# Altium schematic sheet USB 2.0 CONTROLLER.SchDoc: USB 2.0 CONTROLLER
size A4; DrawnBy: ThanhQuoc; Revision: V01; SheetNumber: 15; SheetTotal: 21; Project: RV1126 CAMERA BOARD DESIGN
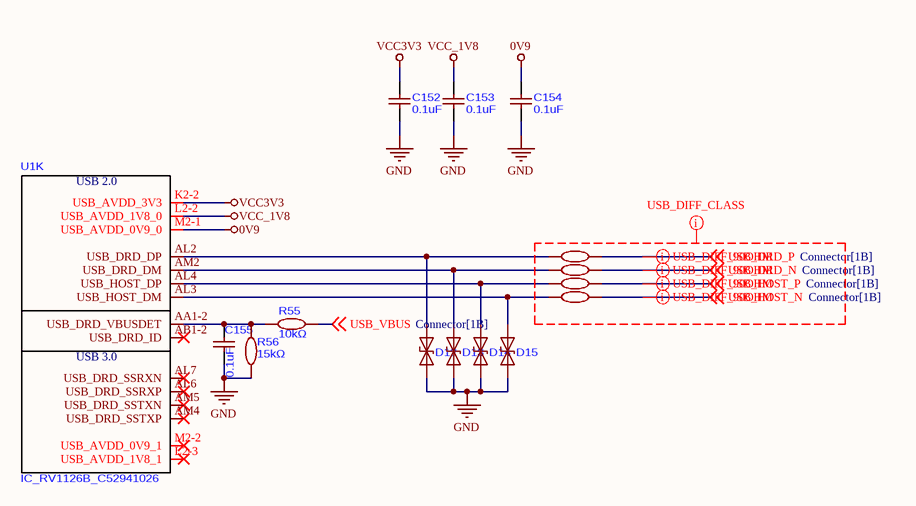
[diagram p0: USB 2.0 CONTROLLER.SchDoc]

## Parts
C152  0.1uF  [C0201]
C153  0.1uF  [C0201]
C154  0.1uF  [C0201]
C155  0.1uF  [C0201]
D12  ESD DIODE  [DSN0603-2_L0.7-W0.3-P0.40-BI]  (value not drawn)
D13  ESD DIODE  [DSN0603-2_L0.7-W0.3-P0.40-BI]  (value not drawn)
D14  ESD DIODE  [DSN0603-2_L0.7-W0.3-P0.40-BI]  (value not drawn)
D15  ESD DIODE  [DSN0603-2_L0.7-W0.3-P0.40-BI]  (value not drawn)
R51  2.2Ω  [R0201]  (value not drawn)
R52  2.2Ω  [R0201]  (value not drawn)
R53  2.2Ω  [R0201]  (value not drawn)
R54  2.2Ω  [R0201]  (value not drawn)
R55  10kΩ  [R0201]
R56  15kΩ  [R0201]
U1  IC_RV1126B_C52941026  [CCSP-491_L14.0-W14.0-TL_RV1126B]  (part K of 18)

## Nets
0V9: C154.2 U1.M2-1(USB_AVDD_0V9_0)
GND: C152.1 C153.1 C154.1 C155.1 D12.1(K) D13.1(K) D14.1(K) D15.1(K) R56.1
VCC3V3: C152.2 U1.K2-2(USB_AVDD_3V3)
VCC_1V8: C153.2 U1.L2-2(USB_AVDD_1V8_0)
USB_DRD_N: R52.2 ; off-sheet USB_DRD_N
USB_DRD_P: R51.2 ; off-sheet USB_DRD_P
USB_HOST_N: R54.2 ; off-sheet USB_HOST_N
USB_HOST_P: R53.2 ; off-sheet USB_HOST_P
USB_VBUS: R55.2 ; off-sheet USB_VBUS
NetC155_2: C155.2 R55.1 R56.2 U1.AA1-2(USB_DRD_VBUSDET)
NetD12_2: D12.2(A) R51.1 U1.AL2(USB_DRD_DP)
NetD13_2: D13.2(A) R52.1 U1.AM2(USB_DRD_DM)
NetD14_2: D14.2(A) R53.1 U1.AL4(USB_HOST_DP)
NetD15_2: D15.2(A) R54.1 U1.AL3(USB_HOST_DM)

Not connected (* = marked no-connect by the designer): U1 AB1-2(USB_DRD_ID)* AL6(USB_DRD_SSRXP)* AL7(USB_DRD_SSRXN)* AM4(USB_DRD_SSTXP)* AM5(USB_DRD_SSTXN)* L2-3(USB_AVDD_1V8_1)* M2-2(USB_AVDD_0V9_1)*

## Layout directives
net class USB_DIFF_CLASS: USB_DRD_N, USB_DRD_P, USB_HOST_N, USB_HOST_P
differential pair; differential pair class USB_DIFF_90OHM: USB_DRD_N, USB_DRD_P, USB_HOST_N, USB_HOST_P

## Notes on the sheet
- Title:
- Drawn By:
- Page Contents:
- Checked By:
- Size:
- Date:
- File:
- License:
- Email:
- A4
- nguyenthanhquoc0206@gmail.com
- Number:
- Time:
- Revision:
- Sheet
- Website:
- of
- https://www.facebook.com/ntq.687
- (in symbol IC_RV1126B_C52941026, part K) USB 2.0; USB 3.0

## Library data of the parts
C152-C155 = CAP_100nF-6.3V-10%-0201_1: 0.1uF ±10% 6.3V Ceramic Capacitor X5R 0201
D12-D15 = PESD5V0H1BSFYL: ESD DIODE 5VWM 5VC DSN0603-2 0.13PF
R51-R54 = RES_2.2-50mW-1%-0201: RES 2.2Ω ±1% 50mW 0201; ComponentLink1Description: LCSC; ComponentLink1URL: https://www.lcsc.com/product-detail/C295718.html?s_z=n_q_t_120%2520OHM&spm=wm.fly.bg.5.xh___wm.ssy.tc.1.tz&lcsc_vid=EwRWBFZSQVIPVFdUTlJfVldeFFRYUFQAElRYBFRRE1MxVlNeRFZeU1BfTlBYVzsOAxUeFF5JWBYZEEoKFBINSQcJGk4eFQsCAgIaSgADAwAHC0slRVhcV1ZTT08GEwkK
R55 = RES_10K-50mW-1%-0201: RES 10KΩ ±1% 50mW 0201; ComponentLink1Description: LCSC; ComponentLink1URL: https://www.lcsc.com/product-detail/C93949.html?spm=wm.fly.bg.0.xh&lcsc_vid=EwRWBFZSQVIPVFdUTlJfVldeFFRYUFQAElRYBFRRE1MxVlNeRVlXUFNQQ1RWXjsOAxUeFF5JWBYZEEoKFBINSQcJGk4eFQsCAgIaSgADAwAHC0slRlVYUFFIHxUDCw%3D%3D
R56 = RES_15K-0.05W-1%-0201: RES 15kΩ ±1% 50mW 0201